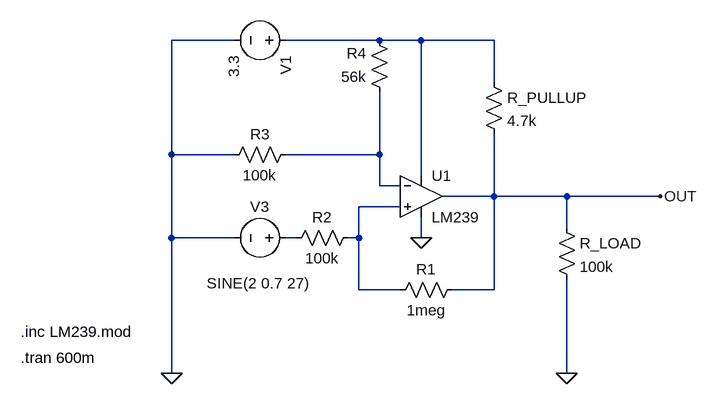
[diagram p0: schematic sim.asc]
sim.asc, the LTspice schematic file:
Version 4
SHEET 1 880 680
WIRE 0 -176 -96 -176
WIRE 224 -176 80 -176
WIRE 288 -176 224 -176
WIRE 400 -176 288 -176
WIRE 400 -112 400 -176
WIRE -96 0 -96 -176
WIRE 0 0 -96 0
WIRE 224 0 224 -96
WIRE 224 0 80 0
WIRE 288 32 288 -176
WIRE 224 48 224 0
WIRE 256 48 224 48
WIRE 400 64 400 -32
WIRE 400 64 320 64
WIRE 512 64 400 64
WIRE 656 64 512 64
WIRE 256 80 192 80
WIRE 512 112 512 64
WIRE -96 128 -96 0
WIRE 0 128 -96 128
WIRE 96 128 80 128
WIRE 192 128 192 80
WIRE 192 128 176 128
WIRE 288 128 288 96
WIRE 192 208 192 128
WIRE 256 208 192 208
WIRE 400 208 400 64
WIRE 400 208 336 208
WIRE -96 336 -96 128
WIRE 512 336 512 192
FLAG -96 336 0
FLAG 288 128 0
FLAG 656 64 OUT
FLAG 512 336 0
SYMBOL voltage 96 -176 R90
WINDOW 123 0 0 Left 2
WINDOW 39 0 0 Left 2
SYMATTR InstName V1
SYMATTR Value 3.3
SYMBOL Opamps\\opamp2 288 0 R0
SYMATTR InstName U1
SYMATTR Value LM239
SYMBOL res 384 -128 R0
SYMATTR InstName R_PULLUP
SYMATTR Value 4.7k
SYMBOL res 352 192 R90
WINDOW 0 0 56 VBottom 2
WINDOW 3 32 56 VTop 2
SYMATTR InstName R1
SYMATTR Value 1meg
SYMBOL voltage 96 128 R90
WINDOW 0 -32 56 VBottom 2
WINDOW 3 54 58 VTop 2
WINDOW 123 0 0 Left 2
WINDOW 39 0 0 Left 2
SYMATTR InstName V3
SYMATTR Value SINE(2 0.7 27)
SYMBOL res 496 96 R0
SYMATTR InstName R_LOAD
SYMATTR Value 100k
SYMBOL res 192 112 R90
WINDOW 0 0 56 VBottom 2
WINDOW 3 32 56 VTop 2
SYMATTR InstName R2
SYMATTR Value 100k
SYMBOL res 96 -16 R90
WINDOW 0 0 56 VBottom 2
WINDOW 3 32 56 VTop 2
SYMATTR InstName R3
SYMATTR Value 100k
SYMBOL res 240 -80 R180
WINDOW 0 36 76 Left 2
WINDOW 3 36 40 Left 2
SYMATTR InstName R4
SYMATTR Value 56k
TEXT -328 272 Left 2 !.inc LM239.mod
TEXT -328 312 Left 2 !.tran 600m

The netlist it stands for:
* sim.asc
V1 N001 0 3.3
XU1 N003 N002 N001 0 OUT LM239  ; pins In+ In- V+ V- OUT
R_PULLUP N001 OUT 4.7k
R1 OUT N003 1meg
V3 N004 0 SINE(2 0.7 27)
R_LOAD OUT 0 100k
R2 N003 N004 100k
R3 N002 0 100k
R4 N002 N001 56k
.inc LM239.mod
.tran 600m
.backanno
.end